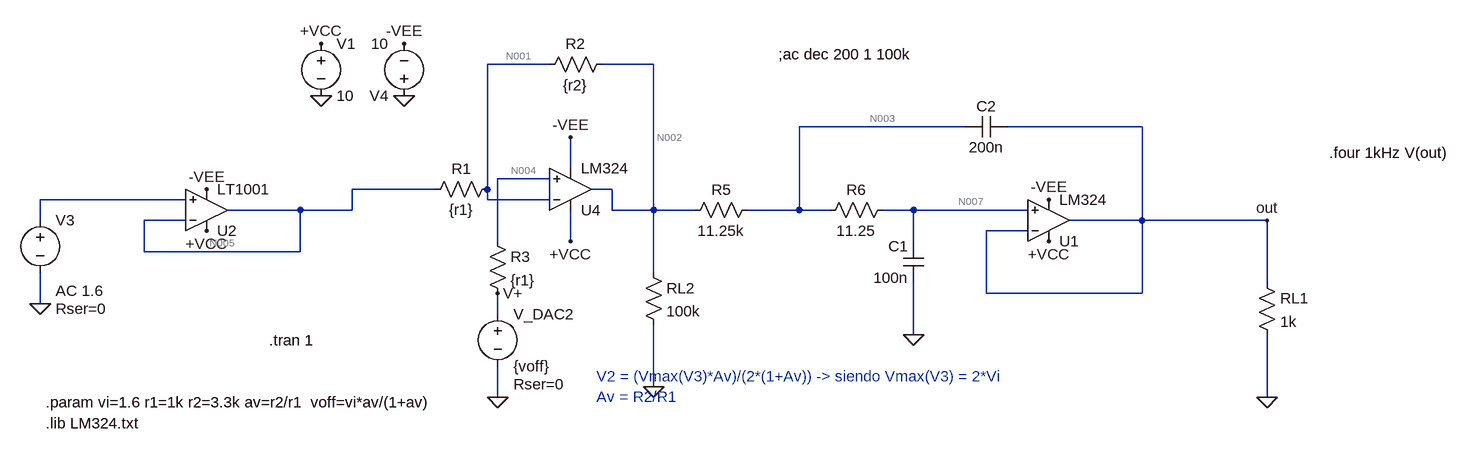
[diagram p0: schematic amplificador_dac_filtro.asc]
amplificador_dac_filtro.asc, the LTspice schematic file:
Version 4
SHEET 1 1920 680
WIRE 80 -80 -16 -80
WIRE 240 -80 160 -80
WIRE 720 16 464 16
WIRE 992 16 784 16
WIRE 112 80 112 32
WIRE 80 96 0 96
WIRE -96 112 -224 112
WIRE -16 112 -16 -80
WIRE 176 112 144 112
WIRE -480 128 -704 128
WIRE -16 128 -16 112
WIRE 80 128 -16 128
WIRE -304 144 -416 144
WIRE -224 144 -224 112
WIRE -224 144 -304 144
WIRE 176 144 176 112
WIRE 240 144 240 -80
WIRE 240 144 176 144
WIRE 304 144 240 144
WIRE 464 144 464 16
WIRE 464 144 384 144
WIRE 512 144 464 144
WIRE 640 144 592 144
WIRE 816 144 640 144
WIRE -704 160 -704 128
WIRE -480 160 -544 160
WIRE 992 160 992 16
WIRE 992 160 880 160
WIRE 1184 160 992 160
WIRE 816 176 752 176
WIRE 0 192 0 96
WIRE 112 192 112 144
WIRE 640 192 640 144
WIRE -544 208 -544 160
WIRE -304 208 -304 144
WIRE -304 208 -544 208
WIRE 240 240 240 144
WIRE 1184 256 1184 160
WIRE 752 272 752 176
WIRE 992 272 992 160
WIRE 992 272 752 272
WIRE -704 288 -704 240
WIRE 0 304 0 272
WIRE 640 336 640 256
WIRE 240 416 240 320
WIRE 0 432 0 384
WIRE 1184 432 1184 336
FLAG 112 192 +VCC
FLAG -272 -32 0
FLAG -272 -112 +VCC
FLAG -704 288 0
FLAG -144 -32 0
FLAG -144 -112 -VEE
FLAG 112 32 -VEE
FLAG 0 432 0
FLAG -448 176 +VCC
FLAG -448 112 -VEE
FLAG 0 272 V+
FLAG 640 336 0
FLAG 1184 432 0
FLAG 848 192 +VCC
FLAG 848 128 -VEE
FLAG 240 416 0
FLAG 1184 160 out
SYMBOL voltage -272 -128 R0
WINDOW 123 0 0 Left 2
WINDOW 39 0 0 Left 2
SYMATTR InstName V1
SYMATTR Value 10
SYMBOL voltage -704 144 R0
WINDOW 123 24 124 Left 2
WINDOW 39 24 152 Left 2
WINDOW 3 24 96 Invisible 2
SYMATTR Value2 AC 1.6
SYMATTR SpiceLine Rser=0
SYMATTR Value PWL TIME_SCALE_FACTOR=1 VALUE_SCALE_FACTOR=1 REPEAT FOREVER (file=senialDAC_0a3.3V_escalon_rapido.txt) ENDREPEAT
SYMATTR InstName V3
SYMBOL res 0 96 R90
WINDOW 0 0 56 VBottom 2
WINDOW 3 32 56 VTop 2
SYMATTR InstName R1
SYMATTR Value {r1}
SYMBOL res 176 -96 R90
WINDOW 0 0 56 VBottom 2
WINDOW 3 32 56 VTop 2
SYMATTR InstName R2
SYMATTR Value {r2}
SYMBOL voltage -144 -16 R180
WINDOW 123 0 0 Left 2
WINDOW 39 0 0 Left 2
SYMATTR InstName V4
SYMATTR Value 10
SYMBOL voltage 0 288 R0
WINDOW 123 0 0 Left 2
WINDOW 39 24 124 Left 2
SYMATTR SpiceLine Rser=0
SYMATTR InstName V_DAC2
SYMATTR Value {voff}
SYMBOL Opamps\\LT1001 -448 208 M180
SYMATTR InstName U2
SYMBOL Opamps\\opamp2 112 176 M180
SYMATTR InstName U4
SYMATTR Value LM324
SYMBOL Opamps\\opamp2 848 224 M180
SYMATTR InstName U1
SYMATTR Value LM324
SYMBOL res 400 128 R90
WINDOW 0 0 56 VBottom 2
WINDOW 3 32 56 VTop 2
SYMATTR InstName R5
SYMATTR Value 11.25k
SYMBOL res 608 128 R90
WINDOW 0 0 56 VBottom 2
WINDOW 3 32 56 VTop 2
SYMATTR InstName R6
SYMATTR Value 11.25
SYMBOL cap 656 256 R180
WINDOW 0 24 56 Left 2
WINDOW 3 24 8 Left 2
SYMATTR InstName C1
SYMATTR Value 100n
SYMBOL cap 784 0 R90
WINDOW 0 0 32 VBottom 2
WINDOW 3 32 32 VTop 2
SYMATTR InstName C2
SYMATTR Value 200n
SYMBOL res 1168 240 R0
SYMATTR InstName RL1
SYMATTR Value 1k
SYMBOL res 224 224 R0
SYMATTR InstName RL2
SYMATTR Value 100k
SYMBOL res -16 176 R0
SYMATTR InstName R3
SYMATTR Value {r1}
TEXT -352 344 Left 2 !.tran 1
TEXT 152 400 Left 2 ;V2 = (Vmax(V3)*Av)/(2*(1+Av)) -> siendo Vmax(V3) = 2*Vi\nAv = R2/R1
TEXT -696 440 Left 2 !.param vi=1.6 r1=1k r2=3.3k av=r2/r1  voff=vi*av/(1+av)
TEXT -696 472 Left 2 !.lib LM324.txt
TEXT 432 -96 Left 2 !;ac dec 200 1 100k
TEXT 1280 56 Left 2 !.four 1kHz V(out)

The netlist it stands for:
* amplificador_dac_filtro.asc
V1 +VCC 0 10
V3 N006 0 PWL TIME_SCALE_FACTOR=1 VALUE_SCALE_FACTOR=1 REPEAT FOREVER (file=senialDAC_0a3.3V_escalon_rapido.txt) ENDREPEAT AC 1.6 Rser=0
R1 N001 N005 {r1}
R2 N002 N001 {r2}
V4 0 -VEE 10
V_DAC2 V+ 0 {voff} Rser=0
XU2 N006 N005 +VCC -VEE N005 LT1001  ; pins In+ In- V+ V- OUT
XU4 N004 N001 +VCC -VEE N002 LM324  ; pins In+ In- V+ V- OUT
XU1 N007 out +VCC -VEE out LM324  ; pins In+ In- V+ V- OUT
R5 N003 N002 11.25k
R6 N007 N003 11.25
C1 0 N007 100n
C2 out N003 200n
RL1 out 0 1k
RL2 N002 0 100k
R3 N004 V+ {r1}
.tran 1
* V2 = (Vmax(V3)*Av)/(2*(1+Av)) -> siendo Vmax(V3) = 2*Vi
* Av = R2/R1
.param vi=1.6 r1=1k r2=3.3k av=r2/r1  voff=vi*av/(1+av)
.lib LM324.txt
;ac dec 200 1 100k
.four 1kHz V(out)
.lib LTC.lib
.backanno
.end

* Results of the author's LTspice run, read from the files saved beside the schematic
* Operating Point, zero values left out:
*   V(+vcc) = 10 V
*   V(n001) = 1.228 V
*   V(n005) = 55.11 nV
*   V(n002) = 5.279 V
*   V(-vee) = -10 V
*   V(v+) = 1.228 V
*   V(n004) = 1.228 V
*   V(out) = 5.279 V
*   V(n007) = 5.28 V
*   V(n003) = 5.28 V
*   I(R3) = 19.77 nA
*   I(Rl2) = 52.79 µA
*   I(Rl1) = 5.279 mA
*   I(R6) = 19.3 nA
*   I(R5) = 19.3 nA
*   I(R2) = 1.228 mA
*   I(R1) = 1.228 mA
*   I(V_dac2) = 19.77 nA
*   I(V4) = -4.245 mA
*   I(V1) = -3.018 mA
*   Ix(u2:3) = 1.678 mA
*   Ix(u2:4) = -2.906 mA
*   Ix(u2:5) = 1.228 mA
*   Ix(u4:1) = -19.77 nA
*   Ix(u4:2) = -19.85 nA
*   Ix(u4:3) = 669.9 µA
*   Ix(u4:4) = -669.8 µA
*   Ix(u4:5) = -1.281 mA
*   Ix(u1:1) = -19.3 nA
*   Ix(u1:2) = -19.5 nA
*   Ix(u1:3) = 669.9 µA
*   Ix(u1:4) = -669.6 µA
*   Ix(u1:5) = -5.279 mA
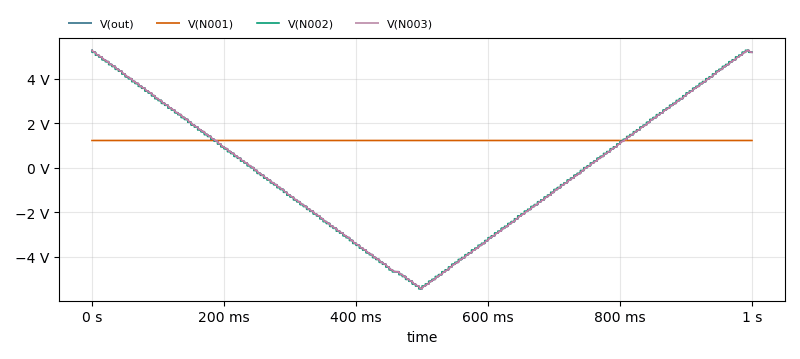
[diagram p1: Transient Analysis of amplificador_dac_filtro.asc, plotted from the saved traces]
* Transient Analysis, 1 run:
*   V(out): min -5.438 V, max 5.279 V, average -66 mV, rms 3.124 V, last 5.195 V
*   V(N001): min 1.226 V, max 1.23 V, average 1.228 V, rms 1.228 V, last 1.228 V
*   V(N002): min -5.44 V, max 5.279 V, average -66.3 mV, rms 3.124 V, last 5.194 V
*   V(N003): min -5.439 V, max 5.28 V, average -65.97 mV, rms 3.124 V, last 5.195 V
* From the log:
*   N-Period=1
*   Fourier components of V(out)
*   DC component:5.19569
*   Harmonic  Frequency   Fourier   Normalized   Phase    Normalized
*    Number     [Hz]     Component   Component  [degree]  Phase [deg]
*       1     1.000e+03  5.780e-04  1.000e+00      1.02°      0.00°
*       2     2.000e+03  2.857e-04  4.943e-01      1.81°      0.79°
*       3     3.000e+03  1.875e-04  3.244e-01      2.19°      1.18°
*       4     4.000e+03  1.384e-04  2.395e-01      2.12°      1.10°
*       5     5.000e+03  1.094e-04  1.893e-01      1.67°      0.65°
*       6     6.000e+03  9.069e-05  1.569e-01      1.03°      0.01°
*       7     7.000e+03  7.783e-05  1.347e-01      0.44°     -0.58°
*       8     8.000e+03  6.847e-05  1.185e-01      0.08°     -0.94°
*       9     9.000e+03  6.125e-05  1.060e-01      0.01°     -1.01°
*   Total Harmonic Distortion: 71.472818%(77.872549%)